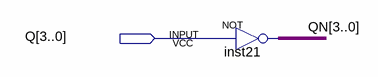
[diagram p0: schematic sheet]
// Quartus schematic LOAD2.bdf as structural Verilog: 1 symbols, 1 pins
module LOAD2 (
  input  [3:0] Q
);

  wire [3:0] QN;

  assign QN = ~Q;  // NOT inst21, 4 bits wide
endmodule
